# EAGLE schematic SoundDetector (EAGLE 7.7.0)
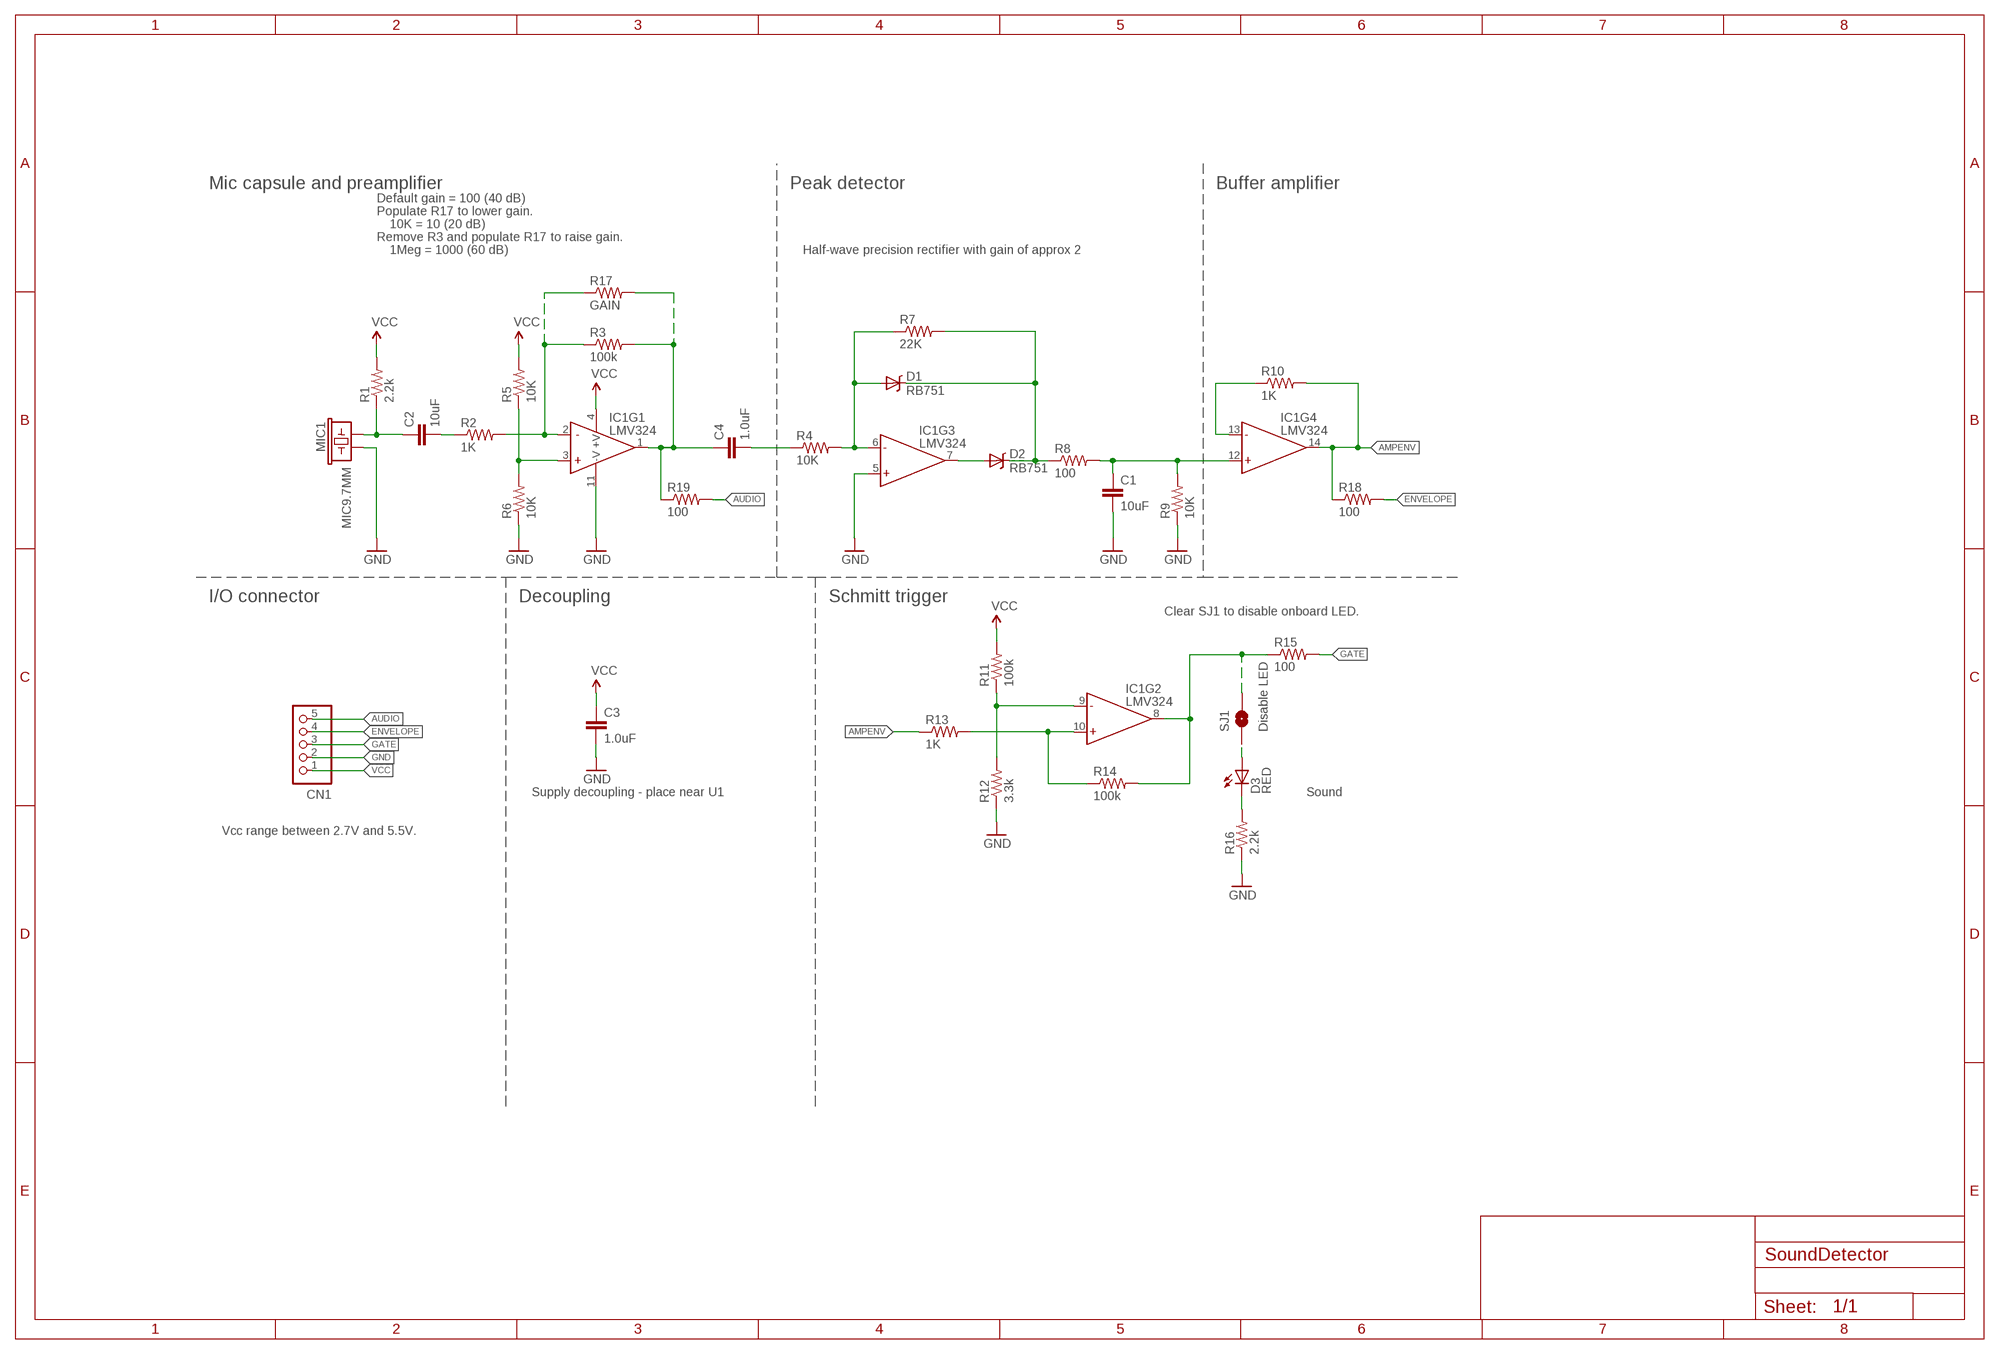
[diagram p0: schematic, sheet 1]

## Parts
C1  10uF  10UF-6.3V-20%(1206)  [1206]
C2  10uF  10UF-6.3V-20%(1206)  [1206]
C3  1.0uF  1.0UF-16V-10%(0603)  [0603-CAP]
C4  1.0uF  1.0UF-16V-10%(0603)  [0603-CAP]
CN1  B5B-PH-K-S  [B5B-PH-K-S]
D1  RB751  [SOD-523]
D2  RB751  [SOD-523]
D3  RED  LED-RED0603  [LED-0603]
IC1  LMV324  [SO014]
MIC1  MIC9.7MM  [MIC-9.7MM]
R1  2.2k  2.2KOHM1/10W1%(0603)  [0603-RES]
R2  1K  1KOHM1/10W1%(0603)  [0603-RES]
R3  100k  100KOHM1/10W1%(0603)  [0603-RES]
R4  10K  10KOHM1/10W1%(0603)0603  [0603-RES]
R5  10K  10KOHM1/10W1%(0603)0603  [0603-RES]
R6  10K  10KOHM1/10W1%(0603)0603  [0603-RES]
R7  22K  22KOHM1/10W1%(0603)  [0603-RES]
R8  100  100OHM1/10W1%(0603)  [0603-RES]
R9  10K  10KOHM1/10W1%(0603)0603  [0603-RES]
R10  1K  1KOHM1/10W1%(0603)  [0603-RES]
R11  100k  100KOHM1/10W1%(0603)  [0603-RES]
R12  3.3k  3.3KOHM1/10W1%(0603)  [0603-RES]
R13  1K  1KOHM1/10W1%(0603)  [0603-RES]
R14  100k  100KOHM1/10W1%(0603)  [0603-RES]
R15  100  100OHM1/10W1%(0603)  [0603-RES]
R16  2.2k  2.2KOHM1/10W1%(0603)  [0603-RES]
R17  GAIN  RESISTORPTH-1/4W-VERT-KIT  [AXIAL-0.1EZ]
R18  100  100OHM1/10W1%(0603)  [0603-RES]
R19  100  100OHM1/10W1%(0603)  [0603-RES]
SJ1  Disable LED  SOLDERJUMPERNC  [SJ_2S]

## Nets
AMPENV: IC1.14(OUT) R10.2 R13.1 R18.1
AUDIO: CN1.5 R19.2
ENVELOPE: CN1.4 R18.2
GATE: CN1.3 R15.2
GND: C3.1 CN1.2 IC1.4(+V) R1.2 R5.2 R11.2 ; supply symbol labelled VCC
N$: C4.1 IC1.1(OUT) R3.2 R17.P$2 R19.1
N$1: C2.1 MIC1.1 R1.1
N$2: IC1.3(+IN) R5.1 R6.2
N$3: D3.C R16.2
N$4: IC1.2(-IN) R2.2 R3.1 R17.P$1
N$5: C2.2 R2.1
N$6: C4.2 R4.1
N$7: D1.A IC1.6(-IN) R4.2 R7.1
N$8: D2.A IC1.7(OUT)
N$9: D1.C D2.C R7.2 R8.1
N$10: C1.1 IC1.12(+IN) R8.2 R9.2
N$11: IC1.13(-IN) R10.1
N$12: D3.A SJ1.1
N$15: IC1.9(-IN) R11.1 R12.2
N$16: IC1.10(+IN) R13.2 R14.1
N$17: IC1.8(OUT) R14.2 R15.1 SJ1.2
VCC: C1.2 C3.2 CN1.1 IC1.5(+IN) IC1.11(-V) MIC1.2 R6.1 R9.1 R12.1 R16.1 ; supply symbol labelled GND

## Notes on the sheet
- Mic capsule and preamplifier | Peak detector | Buffer amplifier
- Default gain = 100 (40 dB)
- Populate R17 to lower gain.
- 10K = 10 (20 dB)
- Remove R3 and populate R17 to raise gain.
- 1Meg = 1000 (60 dB) | Half-wave precision rectifier with gain of approx 2
- I/O connector | Decoupling | Schmitt trigger
- Clear SJ1 to disable onboard LED.
- Supply decoupling - place near U1 | Sound
- Vcc range between 2.7V and 5.5V.

## Library data of the parts
C1 C2 = SparkFun-Capacitors:10UF-6.3V-20%(1206): Ceramic CAP-10057; PROD_ID: CAP-10057
C3 C4 = SparkFun-Capacitors:1.0UF-16V-10%(0603): CAP-00868; PROD_ID: CAP-00868
CN1 = jst-ph:B5B-PH-*: Wire-to-Board 2.0mm pitch top mount connector Source: http://www.jst-mfg.com/product/pdf/jpn/PH.pdf http://www.jst-mfg.com/product/detail.php?series=199
D1 D2 = SparkFun-DiscreteSemi:RB751: 40V 120mA SOD-523 Schottky DIO-11018; PROD_ID: DIO-11018
D3 = SparkFun-LED:LED-RED: Assorted Red LEDs LilyPad 1206- DIO-09912 1206- DIO-00809 0603- DIO-00819; PROD_ID: DIO-00819
IC1 = SparkFun-AnalogIC:LMV324: Jellybean quad op-amp; PROD_ID: IC-08227
MIC1 = SparkFun-Sensors:MIC: Omni-directional electret microphone. 9.7mm standard diameter.; PROD_ID: COMP-08856
R1 R16 = SparkFun-Resistors:2.2KOHM1/10W1%(0603): RES-08272; PROD_ID: RES-08272
R2 R10 R13 = SparkFun-Resistors:1KOHM1/10W1%(0603): RES-07856; PROD_ID: RES-07856
R3 R11 R14 = SparkFun-Resistors:100KOHM1/10W1%(0603): RES-07828; PROD_ID: RES-07828
R4-R6 R9 = SparkFun-Resistors:10KOHM1/10W1%(0603): RES-00824; PROD_ID: RES-00824
R7 = SparkFun-Resistors:22KOHM1/10W1%(0603): RES-07853; PROD_ID: RES-07853
R8 R15 R18 R19 = SparkFun-Resistors:100OHM1/10W1%(0603): RES-07863; PROD_ID: RES-07863
R12 = SparkFun-Resistors:3.3KOHM1/10W1%(0603): RES-07851; PROD_ID: RES-07851
R17 = SparkFun-Resistors:RESISTOR: Resistor Basic schematic elements and footprints for 0603, 1206, and PTH resistors.
SJ1 = SparkFun-Passives:SOLDERJUMPER: Solder Jumper Standard SMD solder jumper. Used to automate production. Two varients : Normally Open and Normally Closed are the same, but have different paste layers. NC will have a large amount of paste and should jumper during reflow.